# EAGLE schematic ECD (EAGLE 9.6.0)
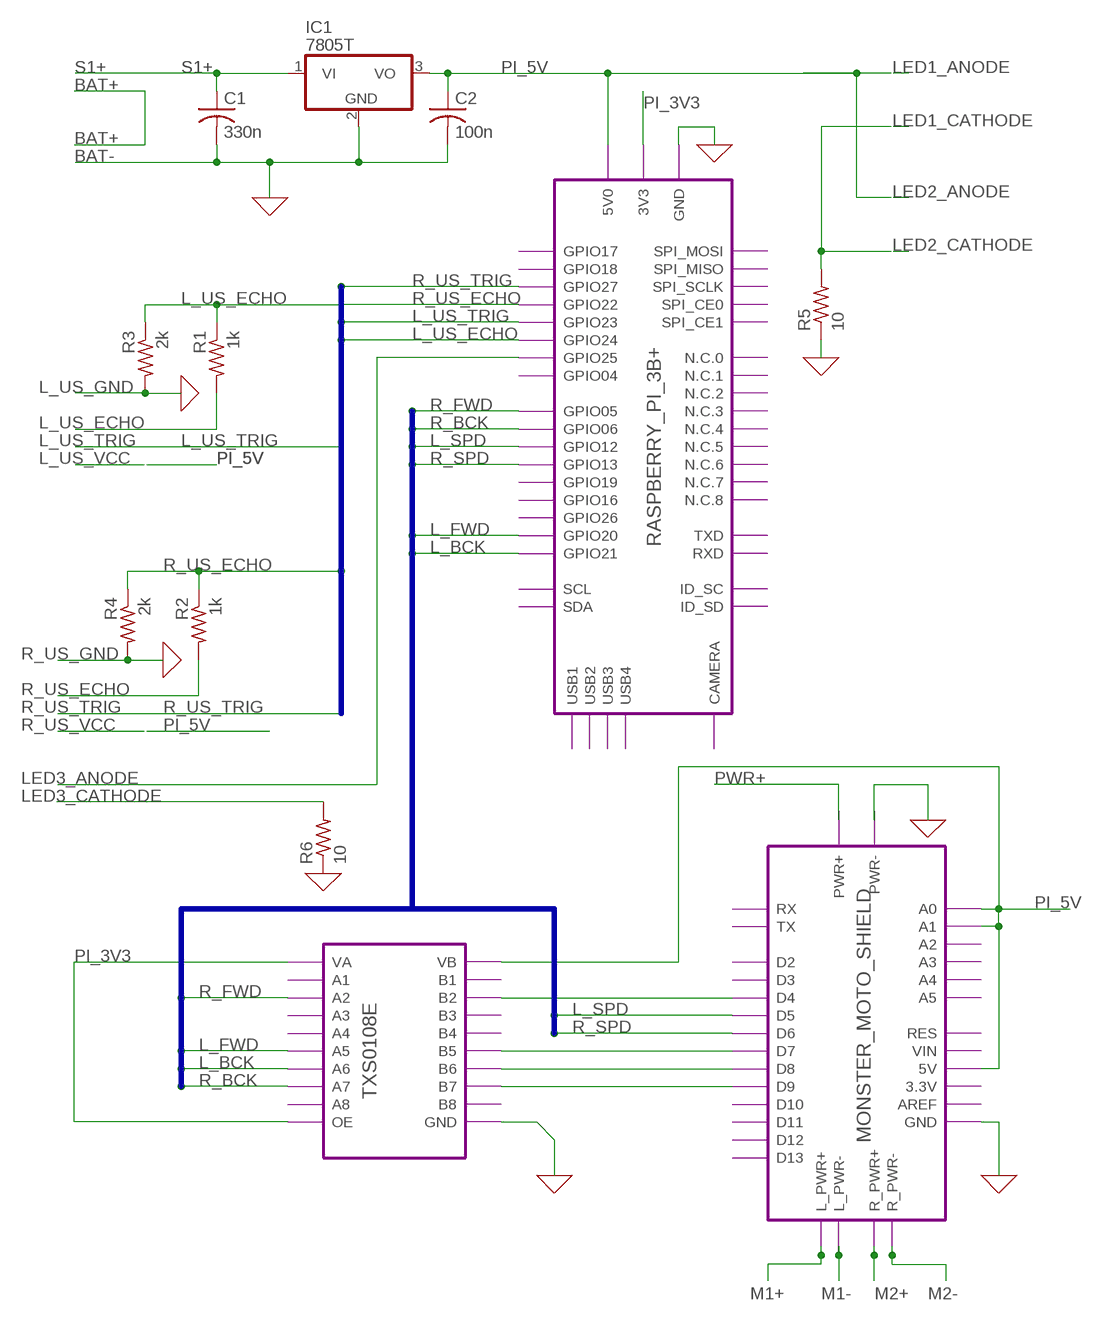
[diagram p0: schematic, sheet 1]

## Parts
C1  330n  C-US025-025X050  [C025-025X050]
C2  100n  C-US025-025X050  [C025-025X050]
IC1  7805T  [TO220H]
R1  1k  R-US_0207/10  [0207/10]
R2  1k  R-US_0207/10  [0207/10]
R3  2k  R-US_0207/10  [0207/10]
R4  2k  R-US_0207/10  [0207/10]
R5  10  R-US_0207/10  [0207/10]
R6  10  R-US_0207/10  [0207/10]

## Module instances
TXS0108E = TXS0108E
MONSTER_MOTO_SHIELD = MONSTER_MOTO_SHIELD
RASPBERRY_PI_3B+ = RASPBERRY_PI_3B+

## Nets
0: R5.1 R6.1 ; port TXS0108E.GND MONSTER_MOTO_SHIELD.GND MONSTER_MOTO_SHIELD.PWR- RASPBERRY_PI_3B+.GND ; supply symbol labelled GND
BAT-: C1.2 C2.2 IC1.2(GND) ; supply symbol labelled GND
L_BCK: port RASPBERRY_PI_3B+.GPIO21 TXS0108E.A6
L_FWD: port RASPBERRY_PI_3B+.GPIO20 TXS0108E.A5
L_SPD: port RASPBERRY_PI_3B+.GPIO12 MONSTER_MOTO_SHIELD.D5
L_US_ECHO: R1.1 R1.2 R3.1 ; port RASPBERRY_PI_3B+.GPIO24
L_US_GND: R3.2 ; supply symbol labelled GND
L_US_TRIG: port RASPBERRY_PI_3B+.GPIO23
LED3_ANODE: port RASPBERRY_PI_3B+.GPIO25
LED3_CATHODE: R6.2
M1+: port MONSTER_MOTO_SHIELD.L_PWR+
M1-: port MONSTER_MOTO_SHIELD.L_PWR-
M2+: port MONSTER_MOTO_SHIELD.R_PWR+
M2-: port MONSTER_MOTO_SHIELD.R_PWR-
N$4: R5.2
N$13: port TXS0108E.B2 MONSTER_MOTO_SHIELD.D4
N$14: port TXS0108E.B5 MONSTER_MOTO_SHIELD.D7
N$15: port TXS0108E.B6 MONSTER_MOTO_SHIELD.D8
N$16: port TXS0108E.B7 MONSTER_MOTO_SHIELD.D9
PI_3V3: port TXS0108E.OE TXS0108E.VA RASPBERRY_PI_3B+.3V3
PI_5V: C2.1 IC1.3(VO) ; port MONSTER_MOTO_SHIELD.A0 MONSTER_MOTO_SHIELD.5V MONSTER_MOTO_SHIELD.A1 TXS0108E.VB RASPBERRY_PI_3B+.5V0
PWR+: port MONSTER_MOTO_SHIELD.PWR+
R_BCK: port RASPBERRY_PI_3B+.GPIO06 TXS0108E.A7
R_FWD: port RASPBERRY_PI_3B+.GPIO05 TXS0108E.A2
R_SPD: port RASPBERRY_PI_3B+.GPIO13 MONSTER_MOTO_SHIELD.D6
R_US_ECHO: R2.1 R2.2 R4.1 ; port RASPBERRY_PI_3B+.GPIO22
R_US_GND: R4.2 ; supply symbol labelled GND
R_US_TRIG: port RASPBERRY_PI_3B+.GPIO27
S1+: C1.1 IC1.1(VI)

## Buses
L_BCK,L_FWD,L_SPD,R_BCK,R_FWD,R_SPD
L_US_ECHO,R_US_ECHO,R_US_TRIG

## Library data of the parts
C1 C2 = rcl:C-US: CAPACITOR, American symbol; SPICEPREFIX: C
IC1 = linear:78*: Positive VOLTAGE REGULATOR Source: http://cache.national.com/ds/LM/LM78L05.pdf http://www.fairchildsemi.com/ds/LM/LM7805.pdf
R1-R6 = resistor:R-US_: RESISTOR, American symbol

## Module TXS0108E
Ports: VA(pwr) A1(io) A2(io) A3(io) A4(io) A5(io) A6(io) A7(io) A8(io) OE(in) VB(pwr) B2(io) B1(io) B3(io) B4(io) B5(io) B6(io) B7(io) B8(io) GND(pwr)
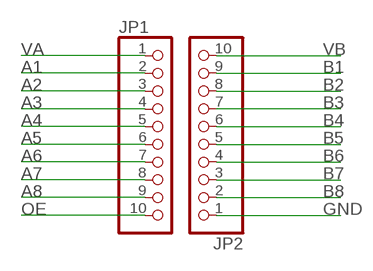
[diagram p1: schematic, module TXS0108E, sheet 1]

### Parts
JP1  PINHD-1X10  [1X10]
JP2  PINHD-1X10  [1X10]

### Nets
A1: JP1.2
A2: JP1.3
A3: JP1.4
A4: JP1.5
A5: JP1.6
A6: JP1.7
A7: JP1.8
A8: JP1.9
B1: JP2.9
B2: JP2.8
B3: JP2.7
B4: JP2.6
B5: JP2.5
B6: JP2.4
B7: JP2.3
B8: JP2.2
GND: JP2.1
OE: JP1.10
VA: JP1.1
VB: JP2.10

### Library data of the parts
JP1 JP2 = pinhead:PINHD-1X10: PIN HEADER

## Module MONSTER_MOTO_SHIELD
Ports: RX(io) TX(io) D2(io) D3(io) D4(io) D5(io) D6(io) D7(io) D8(io) D9(io) D10(io) D11(io) D12(io) D13(io) A0(io) A1(io) A2(io) A3(io) A4(io) A5(io) RES(io) VIN(io) 5V(io) 3.3V(io) AREF(io) GND(io) PWR+(io) PWR-(io) L_PWR+(io) L_PWR-(io) R_PWR+(io) R_PWR-(io)

### Library data of the parts

## Module RASPBERRY_PI_3B+
Ports: GPIO17(io) GPIO18(io) GPIO27(io) GPIO22(io) GPIO23(io) GPIO24(io) GPIO25(io) GPIO04(io) GPIO05(io) GPIO06(io) GPIO12(io) GPIO13(io) GPIO19(io) GPIO16(io) GPIO26(io) GPIO20(io) GPIO21(io) SCL(io) SDA(io) SPI_MOSI(io) SPI_MISO(io) SPI_SCLK(io) SPI_CE0(io) SPI_CE1(io) N.C.0(io) N.C.1(io) N.C.2(io) N.C.3(io) N.C.4(io) N.C.5(io) N.C.6(io) N.C.7(io) N.C.8(io) TXD(io) RXD(io) ID_SC(io) ID_SD(io) 5V0(io) 3V3(io) GND(io) USB1(io) USB2(io) USB3(io) USB4(io) CAMERA(io)

### Library data of the parts

## Module RPI_CAMERA_MODULE
Ports: MICRO_USB(io)

### Library data of the parts

## Module RPLIDAR_A1M8
Ports: INPUT_BUS(io)

### Library data of the parts